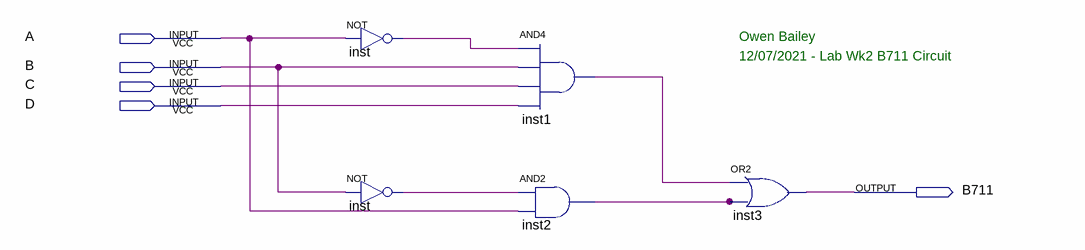
[diagram p0: schematic sheet]
// Quartus schematic b711.bdf as structural Verilog: 5 symbols, 5 pins
module b711 (
  input  A,
  input  B,
  input  C,
  input  D,
  output B711
);

  wire inst1_out, inst2_out, inst_out, inst_out_2;

  not inst (inst_out, A);
  not inst_dup2 (inst_out_2, B);
  and inst1 (inst1_out, inst_out, B, C, D);
  and inst2 (inst2_out, inst_out_2, A);
  or inst3 (B711, inst1_out, inst2_out);

  // Notes on the sheet:
  //   Owen Bailey
  //   12/07/2021 - Lab Wk2 B711 Circuit
endmodule
